# Altium schematic sheet pmic_mt3406_buck.SchDoc
size A
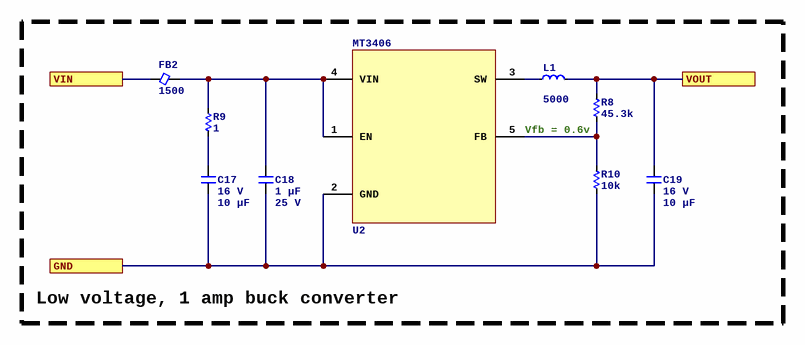
[diagram p0: pmic_mt3406_buck.SchDoc]

## Parts
C17  Voltage Rating: 16 V  Capacitance: 10 µF  [C0805]  (hidden comment: CL21B106KOQNNNE)
C18  Capacitance: 1 µF  Voltage Rating: 25 V  [C0603]  (hidden comment: CL10B105KA8NNNC)
C19  Voltage Rating: 16 V  Capacitance: 10 µF  [C0805]  (hidden comment: CL21B106KOQNNNE)
FB2  Current Rating (mA): 1500  [FB0805]  (hidden comment: MPZ2012S102AT000)
L1  Current Rating (mA): 5000  [SMD-4.1x4.1x2.0]  (hidden comment: FTC404020S4R7MGCA)
R8  value 45.3k  [R0402]  (hidden comment: FRC0402F4532TS)
R9  value 1  [R0402]  (hidden comment: CRCW04021R00FKEDC)
R10  value 10k  [R0402]  (hidden comment: 0402WGF1002TCE)
U2  MT3406  [5SOT23]

## Ports
GND, VIN, VOUT

## Nets
GND: C17.2 C18.2 C19.2 R10.2 U2.2(GND) ; port GND
VIN: FB2.1 ; port VIN
VOUT: C19.1 L1.2 R8.1 ; port VOUT
NetC17_1: C17.1 R9.1
NetC18_1: C18.1 FB2.2 R9.2 U2.1(EN) U2.4(VIN)
NetL1_1: L1.1 U2.3(SW)
NetR8_2: R8.2 R10.1 U2.5(FB)

## Notes on the sheet
- Vfb = 0.6v
- Low voltage, 1 amp buck converter

## Library data of the parts
C17 C19 = CL21B106KOQNNNE: Manufacturer: Samsung Electro-Mechanics; Dielectric: X7R; Manufacturer Part Number: CL21B106KOQNNNE; Package: 0805; Supplier 2: LCSC; Supplier Part Number 2: C95841; ComponentLink1Description: Datasheet; ComponentLink1URL: https://wmsc.lcsc.com/wmsc/upload/file/pdf/v2/lcsc/2304140030_Samsung-Electro-Mechanics-CL21B106KOQNNNE_C95841.pdf
C18 = CL10B105KA8NNNC: Manufacturer: Samsung Electro-Mechanics; Dielectric: X7R; ComponentLink1URL: https://wmsc.lcsc.com/wmsc/upload/file/pdf/v2/lcsc/2304140030_Samsung-Electro-Mechanics-CL10B105KA8NNNC_C29936.pdf; ComponentLink1Description: Datasheet; Manufacturer Part Number: CL10B105KA8NNNC; Package: 0603; Supplier 2: LCSC; Supplier Part Number 2: C29936
FB2 = MPZ2012S102AT000: Manufacturer: TDK; Z @ 100 MHz: 1000; DCR (mOhms): 150; Manufacturer Part Number: MPZ2012S102AT000; Package: 0805; Supplier 2: LCSC; Supplier Part Number 2: C76817; ComponentLink1Description: Datasheet; ComponentLink1URL: https://wmsc.lcsc.com/wmsc/upload/file/pdf/v2/lcsc/2304140030_TDK-MPZ2012S102AT000_C76817.pdf
L1 = FTC404020S4R7MGCA: 4.7 µH SMD power inductor; Manufacturer: cjiang; DCR (mOhms): 58; Inductance (µH): 4.7; Manufacturer Part Number: FTC404020S4R7MGCA; ComponentLink1Description: Datasheet; ComponentLink1URL: https://www.lcsc.com/datasheet/C39676072.pdf; Supplier 2: LCSC; Supplier Part Number 2: C39676072
R8 = FRC0402F4532TS: Manufacturer: FOJAN; Tolerance: 1%; Temperature Coefficient: ±100ppm/?; Power Rating (mW): 62.5; ComponentLink1Description: Datasheet; ComponentLink1URL: https://datasheet.lcsc.com/lcsc/2308241947_FOJAN-FRC0402F4532TS_C2933099.pdf; Manufacturer Part Number: FRC0402F4532TS; Package: 0402; Supplier 2: LCSC; Supplier Part Number 2: C2933099
R9 = CRCW04021R00FKEDC: Manufacturer: Vishay Intertech; Tolerance: 1%; Temperature Coefficient: ±100ppm/?; Power Rating (mW): 62.5; ComponentLink1Description: Datasheet; ComponentLink1URL: https://datasheet.lcsc.com/lcsc/2304140030_Vishay-Intertech-CRCW04021R00FKEDC_C2077765.pdf; Manufacturer Part Number: CRCW04021R00FKEDC; Package: 0402; Supplier 2: LCSC; Supplier Part Number 2: C2077765
R10 = 0402WGF1002TCE: Manufacturer: UNI-ROYAL(Uniroyal Elec); Tolerance: 1%; Temperature Coefficient: ±100ppm/?; Power Rating (mW): 62.5; ComponentLink1Description: Datasheet; ComponentLink1URL: https://wmsc.lcsc.com/wmsc/upload/file/pdf/v2/lcsc/2206010100_UNI-ROYAL-Uniroyal-Elec-0402WGF1002TCE_C25744.pdf; Manufacturer Part Number: 0402WGF1002TCE; Package: 0402; Supplier 2: LCSC; Supplier Part Number 2: C25744
U2 = MT3406: 1 A synchronous buck converter, 2–6 V input, 1.5 MHz, 0.6 V minimum output, 10 µA typical quiescent current, SOT-23-5; Manufacturer: XI'AN Aerosemi Tech; Supplier 2: LCSC; Supplier Part Number 2: C22462728; Manufacturer Part Number: MT3406; ComponentLink1Description: Datasheet; ComponentLink1URL: https://www.lcsc.com/datasheet/C22462728.pdf